# Altium schematic sheet Communication.SchDoc
size A
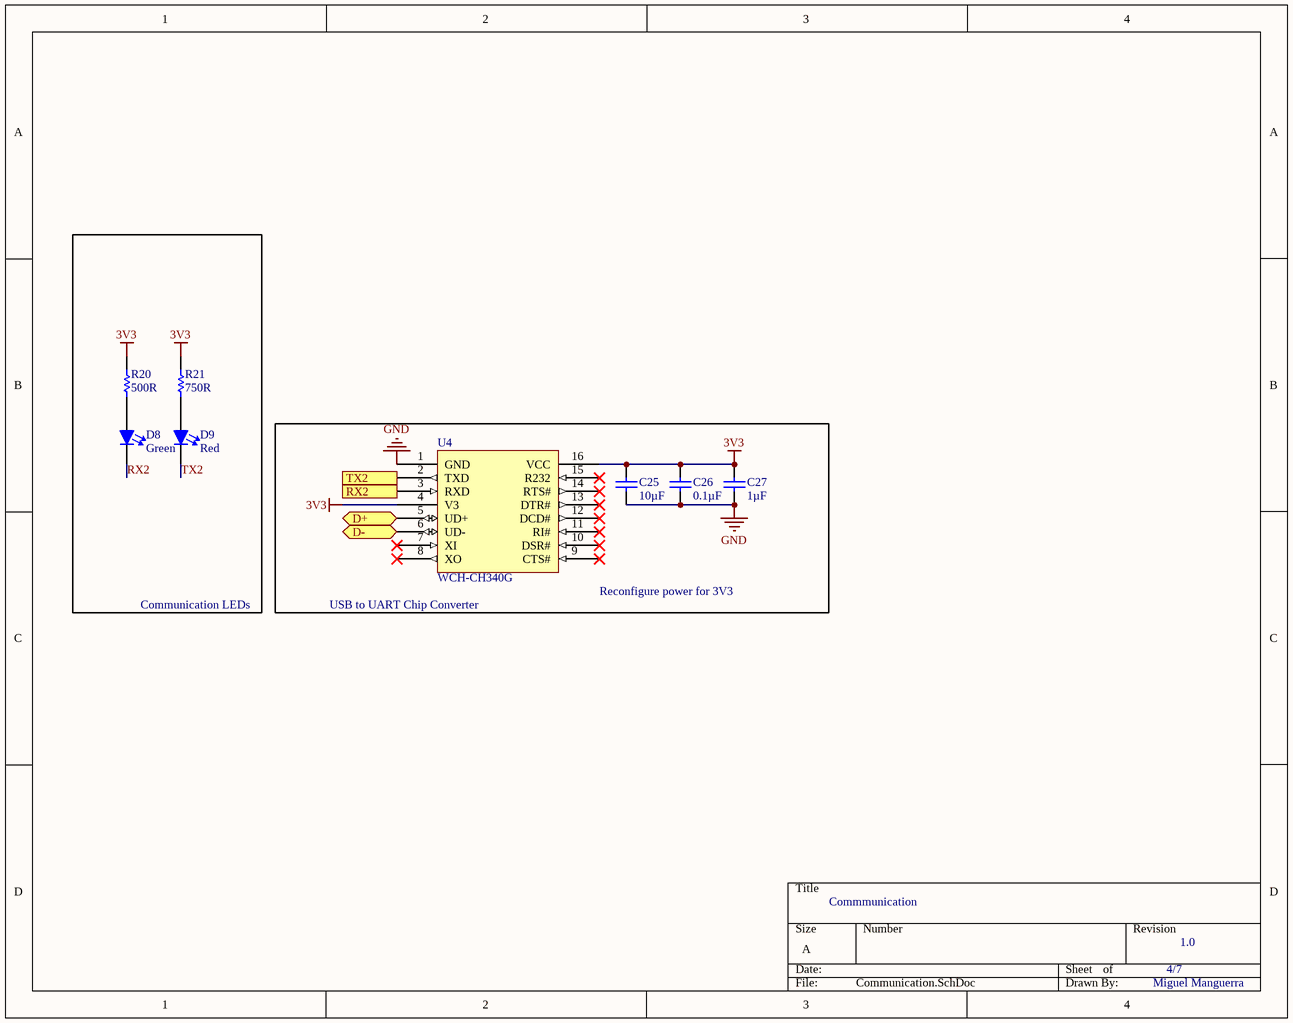
[diagram p0: Communication.SchDoc]

## Parts
C25  value 10µF  [CAPC1608N(0603")]  (hidden comment: 0.1uF 16V 0603 SMD, Ceramic)
C26  value 0.1µF  [CAPC1608N(0603")]  (hidden comment: 0.1uF 16V 0603 SMD, Ceramic)
C27  value 1µF  [CAPC1608N(0603")]  (hidden comment: 1uF 50V 0603 SMD, Ceramic)
D8  Color: Green  [FP-LB_Q39E-MFG]  (hidden comment: LT Q39G-Q1OO-25-1)
D9  Color: Red  [FP-LB_Q39E-MFG]  (hidden comment: LSQ976-NR-1)
R20  Resistance: 500R  [RESC0603(1608)_N]  (hidden comment: RC0603FR-07750RL)
R21  Resistance: 750R  [RESC0603(1608)_N]  (hidden comment: RC0603FR-07750RL)
U4  WCH-CH340G  [SOP127P600X175-16N]

## Blocks framed on the sheet
Communication LEDs: D8 D9 R20 R21

## Ports
D+ (bidir), D- (bidir), RX2 (in), TX2 (out)

## Nets
3V3: C25.2(Cathode) C26.2(Cathode) C27.2(Cathode) R20.1 R21.2 U4.4(V3) U4.16(VCC)
GND: C25.1(Anode) C26.1(Anode) C27.1(Anode) U4.1(GND)
D+: U4.5(UD+) ; port D+
D-: U4.6(UD-) ; port D-
RX2: U4.3(RXD) ; port RX2
RX2: D8.1(Cathode)  [a separate net that carries the same name]
TX2: U4.2(TXD) ; port TX2
TX2: D9.1(Cathode)  [a separate net that carries the same name]
NetD8_2: D8.2(Anode) R20.2
NetD9_2: D9.2(Anode) R21.1

Not connected (* = marked no-connect by the designer): U4 7(XI)* 8(XO)* 9(CTS#)* 10(DSR#)* 11(RI#)* 12(DCD#)* 13(DTR#)* 14(RTS#)* 15(R232)*

## Notes on the sheet
- (near U4) USB to UART Chip Converter
- (near U4) Reconfigure power for 3V3
- Commmunication
- 4/7
- 1.0
- Miguel Manguerra

## Library data of the parts
C25 C26 = CMP-006-0005-1: Capacitor, Ceramic, 16V, +/- 10%, 0603 SMD, X7R; Created By: Andy Bates; Published: 16-04-26; PackageDescription: Chip Capacitor; Pin Count: 2; Source: AUVic_Schematic_Library_Capacitors.SchLib; Design Item ID: 0.1uF 16V 0603 SMD, Ceramic; Component Type: Standard; Publisher: AUVic
C27 = CMP-006-0028-1: Capacitor, Ceramic, 50V, +/- 10%, 0603 SMD, X5R; Design Item ID: 1uF 50V 0603 SMD, Ceramic; Created By: Lyden Smith; PackageDescription: Chip Capacitor; Source: AUVic_Schematic_Library_Capacitors.SchLib; Date Created: 2017-10-26; Pin Count: 2; Component Type: Standard
D8 = CMP-00064-3: LED GREEN DIFFUSED 0603 SMD; Dominant Wavelength: 530nm; Luminous Intensity: 280mcd; Lens Style: Diffused,Colorless,Rectangular; Number of LEDs: 1; Forward Voltage: 2.85V; Test Current: 5mA; Reverse Voltage: 5V; Forward Current: 15mA; Luminous Flux: 0.55lm; Radiation Hardening: No; Packaging: Tape and Reel; Mount: Surface Mount; Max Operating Temperature: 85°C; Number of Elements: 1; Number of Pins: 2; Min Operating Temperature: -40°C; Depth: 0.9mm; Case/Package: SMD/SMT; Length: 1.7mm
D9 = CMP-00066-2: LED Red 645nm 2-Pin Chip 0603(1608Metric) T/R; Lens Transparency: Diffused; Power Dissipation: 65mW; Forward Voltage: 2.5V; Dominant Wavelength: 633nm; Number of Elements: 1; Lens Style: Diffused,Flat,Colorless,Rectangular; Lens Color: White; Viewing Angle: 160°; Luminous Flux: 0.33lm; Test Current: 20mA; Forward Current: 25mA; Luminous Intensity: 180mcd; Reverse Voltage: 12V; Lens Size: 0.8mm; Max Operating Temperature: 85°C; Depth: 0.9mm; Illumination Color: Red; Packaging: Tape and Reel; Min Operating Temperature: -30°C; Case Code (Imperial): 0603; Case Code (Metric): 1608; Number of Pins: 2; Mount: Surface Mount; Height: 0.8mm; Package Quantity: 1; Length: 1.7mm; Width: 0.8mm; Number of LEDs: 1; Case/Package: 0603; Radiation Hardening: No
R20 R21 = CMP-00070-1: Res Thick Film 0603 750 Ohm 1% 0.1W(1/10W) ±100ppm/C Epoxy SMD T/R; Voltage Rating (DC): 50V; Power Rating: 100mW; Temperature Coefficient: 100ppm/°C; Height: 0.022inch; Tolerance: 1%; Voltage Rating: 50V; Case Code (Metric): 1608; Packaging: Tape and Reel; Depth: 0.8mm; Package Quantity: 1; Termination: SMD/SMT; Number of Terminations: 2; Min Operating Temperature: -55°C; Case/Package: 0603; Composition: Thick Film; Width: 0.031inch; Max Operating Temperature: 155°C; Max Power Dissipation: 100mW; Length: 1.6mm; Military Standard: Not; Features: Moisture Resistant; Case Code (Imperial): 0603; Lead Free: Lead Free
U4 = CMP-031-0001-1: USB to UART Transceiver. USB 2.0 2Mbps. LCSC #C14267; LCSC Part Number: C14267